# EAGLE schematic workshopelectro (EAGLE 8.7.1)
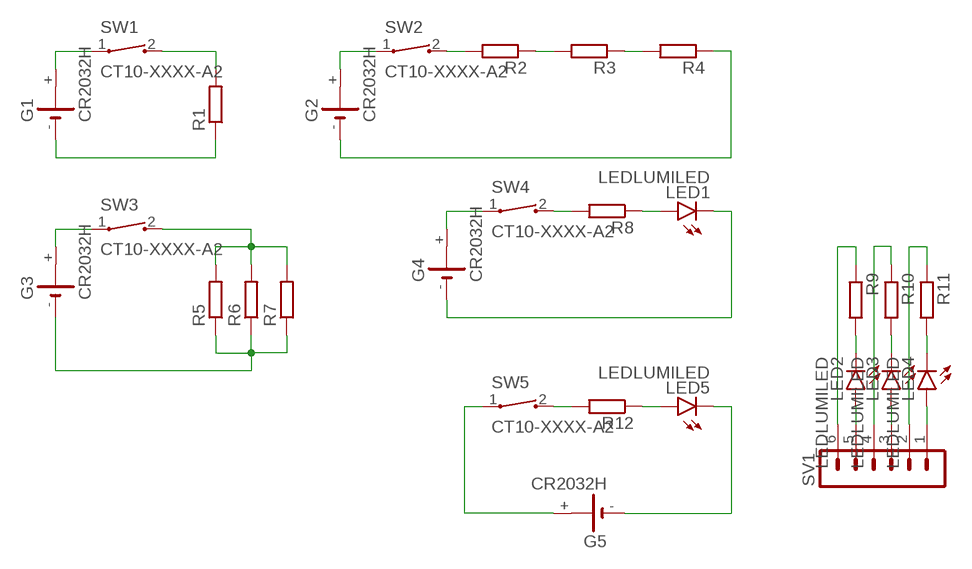
[diagram p0: schematic, sheet 1]

## Parts
G1  CR2032H  [CR2032H]
G2  CR2032H  [CR2032H]
G3  CR2032H  [CR2032H]
G4  CR2032H  [CR2032H]
G5  CR2032H  [CR2032H]
LED1  LEDLUMILED  [LUMILED]
LED2  LEDLUMILED  [LUMILED]
LED3  LEDLUMILED  [LUMILED]
LED4  LEDLUMILED  [LUMILED]
LED5  LEDLUMILED  [LUMILED]
R1  R-EU_0204/2V  [0204V]
R2  R-EU_0204/2V  [0204V]
R3  R-EU_0204/2V  [0204V]
R4  R-EU_0204/2V  [0204V]
R5  R-EU_0204/2V  [0204V]
R6  R-EU_0204/2V  [0204V]
R7  R-EU_0204/2V  [0204V]
R8  R-EU_0204/2V  [0204V]
R9  R-EU_0204/2V  [0204V]
R10  R-EU_0204/2V  [0204V]
R11  R-EU_0204/2V  [0204V]
R12  R-EU_0204/2V  [0204V]
SV1  MA06-1  [MA06-1]
SW1  CT10-XXXX-A2  [CT10-XXXX-A2]
SW2  CT10-XXXX-A2  [CT10-XXXX-A2]
SW3  CT10-XXXX-A2  [CT10-XXXX-A2]
SW4  CT10-XXXX-A2  [CT10-XXXX-A2]
SW5  CT10-XXXX-A2  [CT10-XXXX-A2]

## Nets
N$1: G1.+ SW1.1
N$2: R1.2 SW1.2
N$3: G1.- R1.1
N$4: G2.+ SW2.1
N$5: R2.2 SW2.2
N$6: G2.- R4.1
N$7: R2.1 R3.2
N$8: R3.1 R4.2
N$9: G3.+ SW3.1
N$10: G3.- R5.1 R6.1 R7.1
N$11: LED1.2+(A) R8.1
N$12: R5.2 R6.2 R7.2 SW3.2
N$13: G5.+ SW5.1
N$14: G4.+ SW4.1
N$15: R8.2 SW4.2
N$16: G4.- LED1.4-(C)
N$17: LED2.2+(A) SV1.5
N$18: LED3.2+(A) SV1.3
N$19: LED4.2+(A) SV1.1
N$20: LED2.4-(C) R9.2
N$21: LED3.4-(C) R10.2
N$22: LED4.4-(C) R11.2
N$23: R9.1 SV1.6
N$24: R10.1 SV1.4
N$25: R11.1 SV1.2
N$26: R12.2 SW5.2
N$27: G5.- LED5.4-(C)
N$28: LED5.2+(A) R12.1
Unconnected: G1.+@1(+) G2.+@1(+) G3.+@1(+) G4.+@1(+) G5.+@1(+)

## Library data of the parts
G1-G5 = battery:CR2032H: LI BATTERY Varta
LED1-LED5 = led-lumiled:LED: LED - LUMILED® LXK2-PW12-R00, LXK2-PW12-S00, LXK2-PW14-U00, LXK2-PW14-V00 LXK2-PM12-R00, LXK2-PM12-S00, LXK2-PM14-U00 LXK2-PE12-Q00, LXK2-PE12-R00, LXK2-PE12-S00, LXK2-PE14-T00, LXK2-PE14-U00 LXK2-PB12-K00, LXK2-PB12-L00, LXK2-PB12-M00, LXK2-PB14-N00, LXK2-PB14-P00, LXK2-PB14-Q00 LXK2-PR12-L00, LXK2-PR12-M00, LXK2-PR14-Q00, LXK2-PR14-R00 LXK2-PD12-Q00, LXK2-PD12-R00, LXK2-PD12-S00 LXK2-PH12-R00, LXK2-PH12-S00 LXK2-PL12-P00, LXK2-PL12-Q00, LXK2-PL12-R00 Source: www.luxeon.com; OC_FARNELL: unknown; OC_NEWARK: unknown
R1-R12 = resistor:R-EU_: RESISTOR, European symbol
SV1 = con-lstb:MA06-1: PIN HEADER; OC_FARNELL: unknown; OC_NEWARK: unknown
SW1-SW5 = switch-coto:CT10-XXXX-: CT10 Series Molded Switch Source: www.cotorelay.com .. Coto_Technology__CT10-1530-G1.pdf